# EAGLE design OMHBN (EAGLE 5.11)

## Sheet 1 of 2
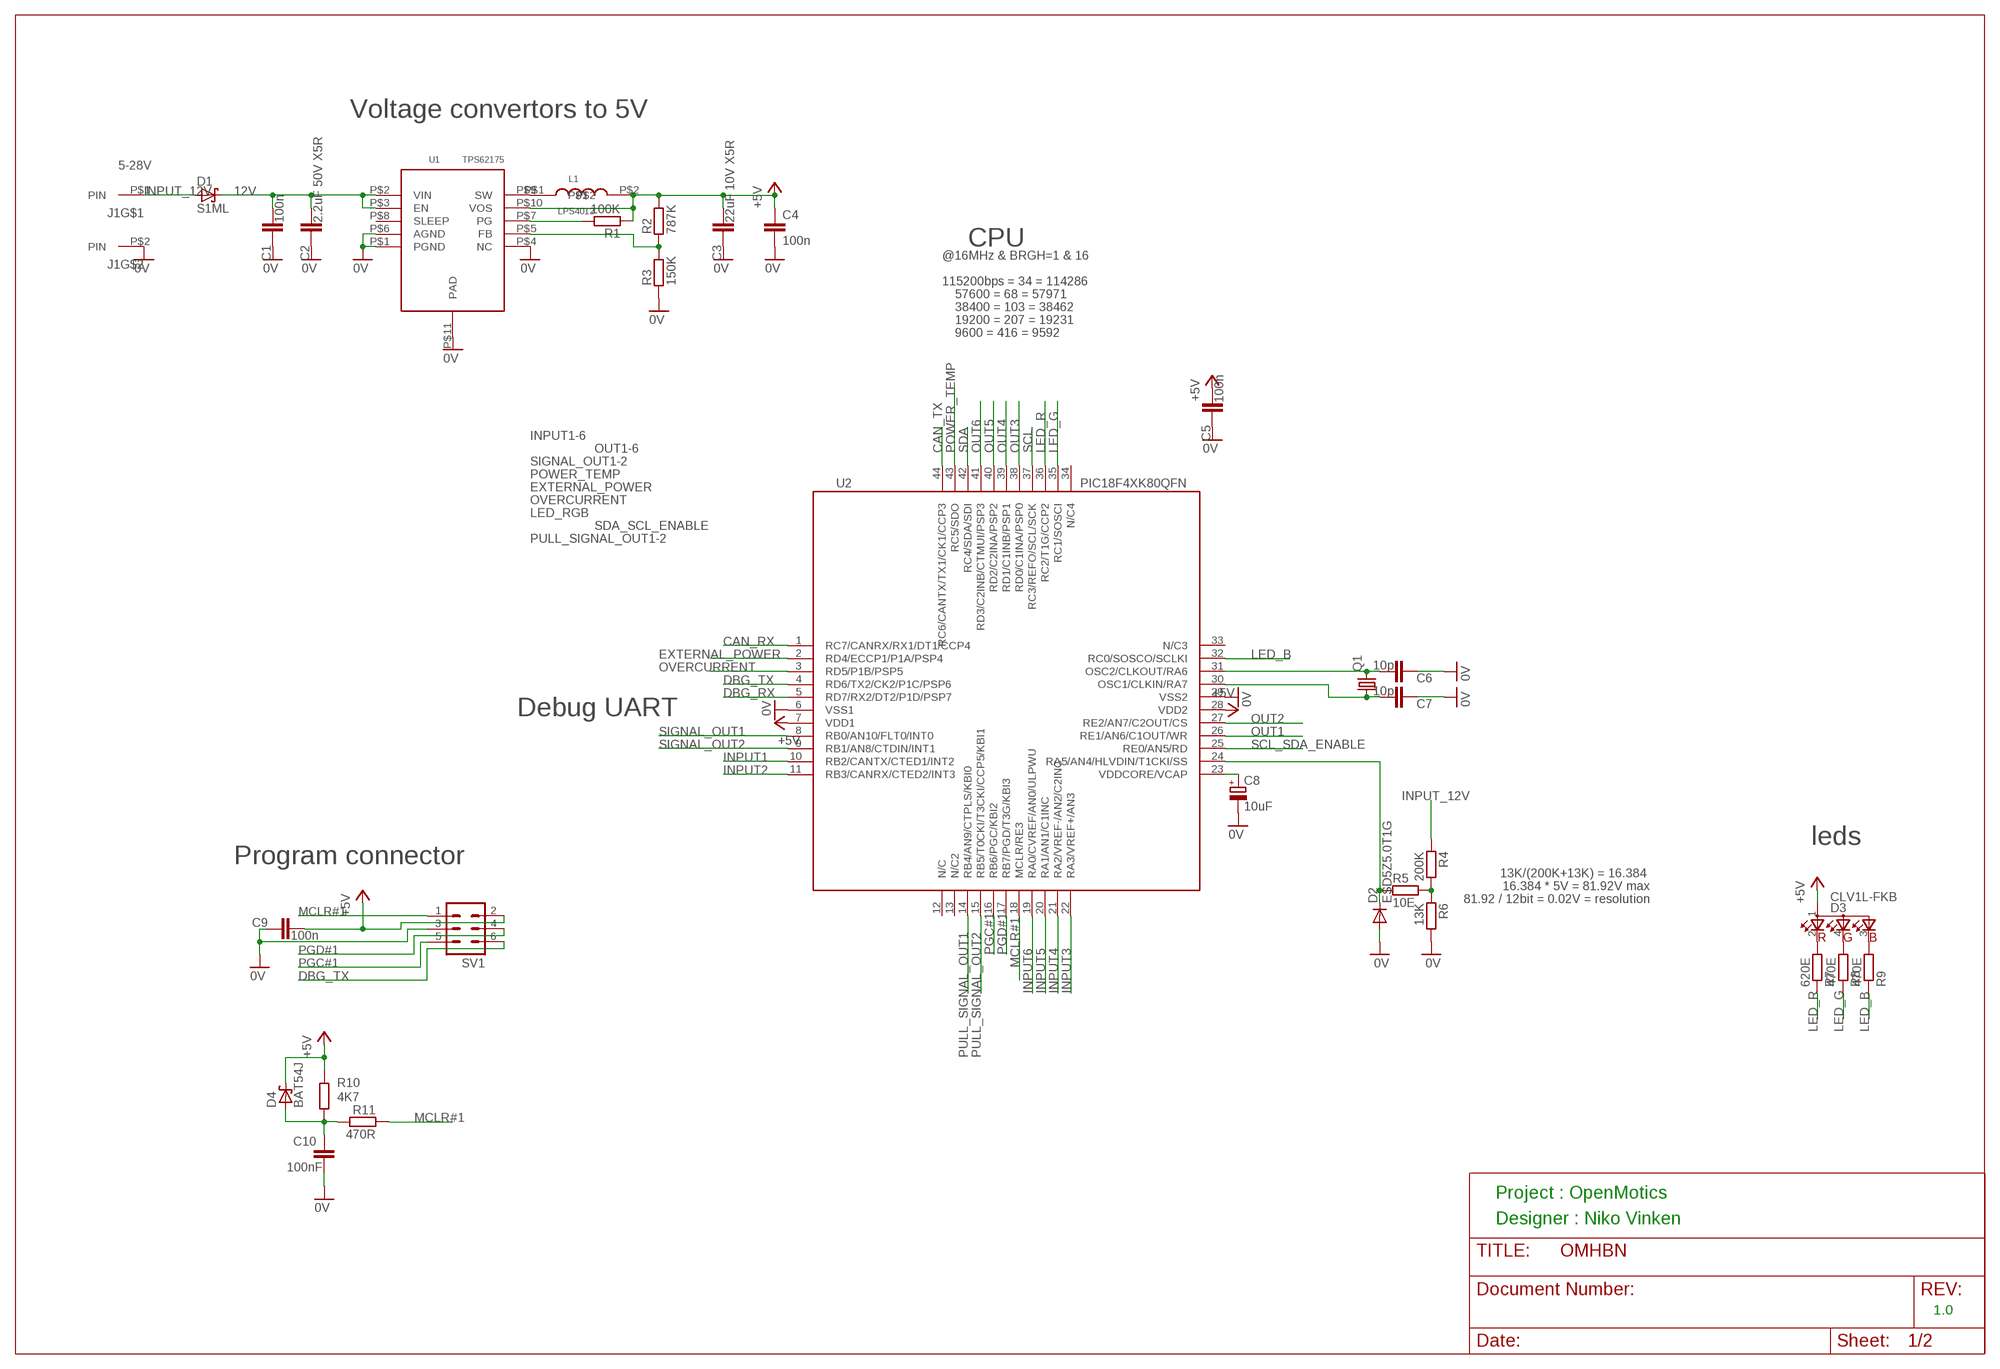
[diagram p0: schematic, sheet 1]

### Parts
C1  100n  C-EUC0603  [C0603]
C2  2.2uF 50V X5R  C-EUC1206  [C1206]
C3  22uF 10V X5R  C-EUC1206  [C1206]
C4  100n  C-EUC0603  [C0603]
C5  100n  C-EUC0603  [C0603]
C6  10p  C-EUC0603  [C0603]
C7  10p  C-EUC0603  [C0603]
C8  10uF  CPOL-EUA/3216-18W  [A/3216-18W]
C9  100n  C-EUC0603  [C0603]
C10  100nF  C-EUC0603  [C0603]
D1  S1ML  SMF5.0AT1  [SOD123FL]
D2  ESD5Z5.0T1G  DIODE-SOD523  [SOD523]
D3  CLV1L-FKB  [PLCC4]
D4  BAT54J  [SOD323_REFLOW]
J1  TERMINAL_2PIN3.81MM  [2PIN_TERMINAL_3.8MM]
L1  LPS4012  [LPS4012_REC]
Q1  CRYSTALCTS406  [CTS406]
R1  100K  R-EU_R0603  [R0603]
R2  787K  R-EU_R0603  [R0603]
R3  150K  R-EU_R0603  [R0603]
R4  200K  R-EU_R0603  [R0603]
R5  10E  R-EU_R0603  [R0603]
R6  13K  R-EU_R0603  [R0603]
R7  620E  R-EU_R0603  [R0603]
R8  470E  R-EU_R0603  [R0603]
R9  470E  R-EU_R0603  [R0603]
R10  4K7  R-EU_R0603  [R0603]
R11  470R  R-EU_R0603  [R0603]
SV1  MA03-2  [MA03-2]
U1  TPS62175  [QFN10]
U2  PIC18F4XK80QFN  [QFN44ML8X8]

### Nets
0V: C1.2 C2.2 C3.2 C4.2 C5.2 C6.2 C7.2 C8.- C9.2 C10.1 D2.A J1.P$2 R3.1 R6.2 SV1.3 U1.P$1(PGND) U1.P$4(NC) U1.P$6(AGND) U1.P$11(PAD) U2.6(VSS1) U2.29(VSS2) ; also sheet 2
12V: C1.1 C2.1 D1.C U1.P$2(VIN) U1.P$3(EN)
+5V: C3.1 C4.1 C5.1 C9.1 D3.1(A2) D4.1 L1.P$2 R1.1 R2.2 R10.2 SV1.2 U1.P$10(VOS) U2.7(VDD1) U2.28(VDD2) ; also sheet 2
CAN_RX: U2.1(RC7/CANRX/RX1/DT1/CCP4) ; also sheet 2
CAN_TX: U2.44(RC6/CANTX/TX1/CK1/CCP3) ; also sheet 2
DBG_RX: U2.5(RD7/RX2/DT2/P1D/PSP7)
DBG_TX: SV1.6 U2.4(RD6/TX2/CK2/P1C/PSP6)
EXTERNAL_POWER: U2.2(RD4/ECCP1/P1A/PSP4) ; also sheet 2
INPUT1: U2.10(RB2/CANTX/CTED1/INT2) ; also sheet 2
INPUT2: U2.11(RB3/CANRX/CTED2/INT3) ; also sheet 2
INPUT3: U2.22(RA3/VREF+/AN3) ; also sheet 2
INPUT4: U2.21(RA2/VREF-/AN2/C2INC) ; also sheet 2
INPUT5: U2.20(RA1/AN1/C1INC) ; also sheet 2
INPUT6: U2.19(RA0/CVREF/AN0/ULPWU) ; also sheet 2
INPUT_12V: D1.A J1.P$1 R4.1
LED_B: R9.1 U2.32(RC0/SOSCO/SCLKI)
LED_G: R8.1 U2.35(RC1/SOSCI)
LED_R: R7.1 U2.36(RC2/T1G/CCP2)
MCLR#1: R11.1 SV1.1 U2.18(MCLR/RE3)
N$1: R4.2 R5.2 R6.1
N$2: R1.2 U1.P$7(PG)
N$3: C10.2 D4.2 R10.1 R11.2
N$4: L1.P$1 U1.P$9(SW)
N$6: R2.1 R3.2 U1.P$5(FB)
N$10: D3.2(CRED) R7.2
N$11: D3.4(CBLUE) R8.2
N$12: D3.3(CGREEN) R9.2
N$19: D2.C R5.1 U2.24(RA5/AN4/HLVDIN/T1CKI/SS)
N$21: C7.1 Q1.1 U2.30(OSC1/CLKIN/RA7)
N$23: C6.1 Q1.3 U2.31(OSC2/CLKOUT/RA6)
N$33: C8.+ U2.23(VDDCORE/VCAP)
OUT1: U2.26(RE1/AN6/C1OUT/WR) ; also sheet 2
OUT2: U2.27(RE2/AN7/C2OUT/CS) ; also sheet 2
OUT3: U2.38(RD0/C1INA/PSP0) ; also sheet 2
OUT4: U2.39(RD1/C1INB/PSP1) ; also sheet 2
OUT5: U2.40(RD2/C2INA/PSP2) ; also sheet 2
OUT6: U2.41(RD3/C2INB/CTMUI/PSP3) ; also sheet 2
OVERCURRENT: U2.3(RD5/P1B/PSP5) ; also sheet 2
PGC#1: SV1.5 U2.16(RB6/PGC/KBI2)
PGD#1: SV1.4 U2.17(RB7/PGD/T3G/KBI3)
POWER_TEMP: U2.43(RC5/SDO) ; also sheet 2
PULL_SIGNAL_OUT1: U2.14(RB4/AN9/CTPLS/KBI0) ; also sheet 2
PULL_SIGNAL_OUT2: U2.15(RB5/T0CKI/T3CKI/CCP5/KBI1) ; also sheet 2
SCL: U2.37(RC3/REFO/SCL/SCK) ; also sheet 2
SCL_SDA_ENABLE: U2.25(RE0/AN5/RD) ; also sheet 2
SDA: U2.42(RC4/SDA/SDI) ; also sheet 2
SIGNAL_OUT1: U2.8(RB0/AN10/FLT0/INT0) ; also sheet 2
SIGNAL_OUT2: U2.9(RB1/AN8/CTDIN/INT1) ; also sheet 2
Unconnected: U1.P$8(SLEEP) U2.12(N/C) U2.13(N/C2) U2.33(N/C3) U2.34(N/C4)

### Notes on the sheet
- Voltage convertors to 5V
- 5-28V
- CPU
- @16MHz & BRGH=1 & 16
- 115200bps = 34 = 114286
- 57600 = 68 = 57971
- 38400 = 103 = 38462
- 19200 = 207 = 19231
- 9600 = 416 = 9592
- INPUT1-6
- OUT1-6
- SIGNAL_OUT1-2
- POWER_TEMP
- EXTERNAL_POWER
- OVERCURRENT
- LED_RGB
- SDA_SCL_ENABLE
- PULL_SIGNAL_OUT1-2
- Debug UART
- leds
- Program connector
- 13K/(200K+13K) = 16.384
- 16.384 * 5V = 81.92V max
- 81.92 / 12bit = 0.02V = resolution
- Project : OpenMotics
- Designer : Niko Vinken
- 1.0

## Sheet 2 of 2
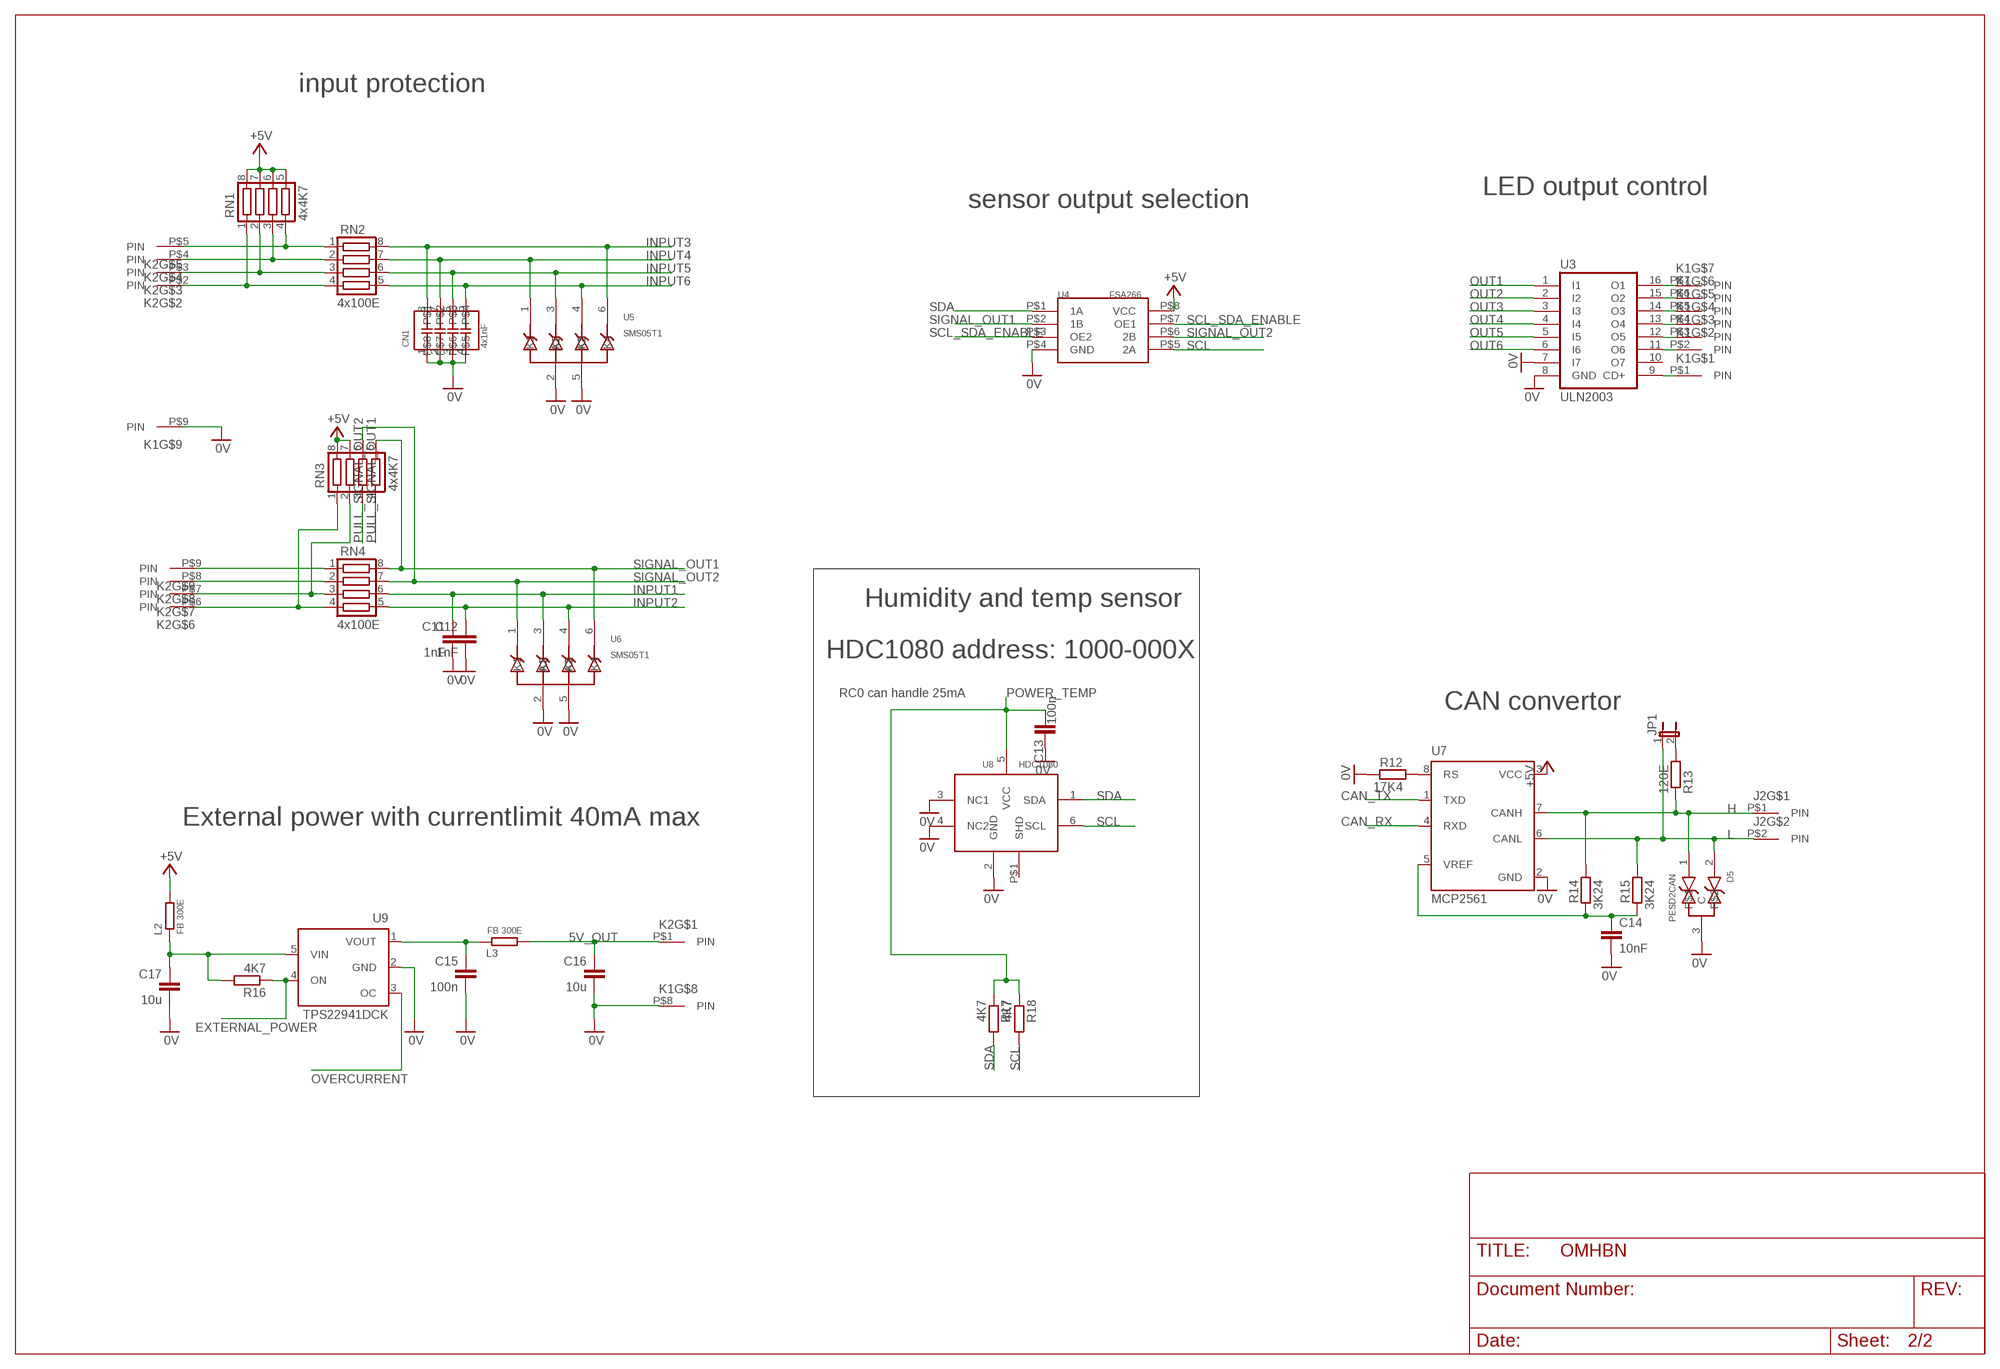
[diagram p1: schematic, sheet 2]

### Parts
C11  1nF  C-EUC0603  [C0603]
C12  1nF  C-EUC0603  [C0603]
C13  100n  C-EUC0603  [C0603]
C14  10nF  C-EUC0603  [C0603]
C15  100n  C-EUC0603  [C0603]
C16  10u  C-EUC0805  [C0805]
C17  10u  C-EUC0805  [C0805]
CN1  4x1nF  C_ARRAY  [C_ARRAY]
D5  PESD2CAN  NUP2105L  [SOT23]
J2  TERMINAL_2PIN3.81MM  [2PIN_TERMINAL_3.8MM]
JP1  JP1E  [JP1]
K1  SOLDER_PIN_9  [SOLDER_PIN_9]
K2  SOLDER_PIN_9  [SOLDER_PIN_9]
L2  FB 300E  WEERSTAND0603_REFLOW  [0603_REFLOW]
L3  FB 300E  WEERSTAND0603_REFLOW  [0603_REFLOW]
R12  17K4  R-EU_R0603  [R0603]
R13  120E  R-EU_R0603  [R0603]
R14  3K24  R-EU_R0603  [R0603]
R15  3K24  R-EU_R0603  [R0603]
R16  4K7  R-EU_R0603  [R0603]
R17  4K7  R-EU_R0603  [R0603]
R18  4K7  R-EU_R0603  [R0603]
RN1  4x4K7  CTS742C083  [CTS742C083]
RN2  4x100E  CTS742C083  [CTS742C083]
RN3  4x4K7  CTS742C083  [CTS742C083]
RN4  4x100E  CTS742C083  [CTS742C083]
U3  ULN2003  [TSSOP16]
U4  FSA266  [US8]
U5  SMS05T1  [SC-74]
U6  SMS05T1  [SC-74]
U7  MCP2561  PCA82C250T  [SO8]
U8  HDC1080  [PWSON_N6]
U9  TPS22941DCK  [DCK]

### Nets
0V: C11.2 C12.2 C13.2 C14.2 C15.2 C16.2 C17.2 CN1.1 CN1.2 CN1.3 CN1.4 D5.3(C) K1.P$8 K1.P$9 R12.1 U3.7(I7) U3.8(GND) U4.P$4(GND) U5.2(A1) U5.5(A2) U6.2(A1) U6.5(A2) U7.2(GND) U8.2(GND) U8.3(NC1) U8.4(NC2) U9.2(GND) ; also sheet 1
5V_OUT: C16.1 K2.P$1 L3.1
+5V: L2.2 RN1.5 RN1.6 RN1.7 RN1.8 RN3.7 RN3.8 U4.P$8(VCC) U7.3(VCC) ; also sheet 1
A: D5.1 J2.P$1 R13.1 R14.2 U7.7(CANH)
B: D5.2 J2.P$2 JP1.1 R15.2 U7.6(CANL)
CAN_RX: U7.4(RXD) ; also sheet 1
CAN_TX: U7.1(TXD) ; also sheet 1
EXTERNAL_POWER: R16.1 U9.4(ON) ; also sheet 1
INPUT1: C11.1 RN4.6 U6.3(K2) ; also sheet 1
INPUT2: C12.1 RN4.5 U6.4(K3) ; also sheet 1
INPUT3: CN1.8 RN2.8 U5.6(K4) ; also sheet 1
INPUT4: CN1.7 RN2.7 U5.1(K1) ; also sheet 1
INPUT5: CN1.6 RN2.6 U5.3(K2) ; also sheet 1
INPUT6: CN1.5 RN2.5 U5.4(K3) ; also sheet 1
N$5: JP1.2 R13.2
N$7: K1.P$1 U3.9(CD+)
N$8: C17.1 L2.1 R16.2 U9.5(VIN)
N$9: K1.P$2 U3.11(O6)
N$13: K2.P$7 RN3.2 RN4.3
N$14: K2.P$8 RN4.2
N$15: K2.P$9 RN4.1
N$16: K1.P$3 U3.12(O5)
N$17: K2.P$6 RN3.1 RN4.4
N$18: K1.P$4 U3.13(O4)
N$20: K1.P$7 U3.16(O1)
N$22: R12.2 U7.8(RS)
N$24: K1.P$6 U3.15(O2)
N$25: K2.P$2 RN1.1 RN2.4
N$26: K2.P$3 RN1.2 RN2.3
N$27: K1.P$5 U3.14(O3)
N$30: K2.P$4 RN1.3 RN2.2
N$31: K2.P$5 RN1.4 RN2.1
N$50: C15.1 L3.2 U9.1(VOUT)
N$56: C14.1 R14.1 R15.1 U7.5(VREF)
OUT1: U3.1(I1) ; also sheet 1
OUT2: U3.2(I2) ; also sheet 1
OUT3: U3.3(I3) ; also sheet 1
OUT4: U3.4(I4) ; also sheet 1
OUT5: U3.5(I5) ; also sheet 1
OUT6: U3.6(I6) ; also sheet 1
OVERCURRENT: U9.3(OC) ; also sheet 1
POWER_TEMP: C13.1 R17.1 R18.1 U8.5(VCC) ; also sheet 1
PULL_SIGNAL_OUT1: RN3.4 ; also sheet 1
PULL_SIGNAL_OUT2: RN3.3 ; also sheet 1
SCL: R18.2 U4.P$5(2A) U8.6(SCL) ; also sheet 1
SCL_SDA_ENABLE: U4.P$3(OE2) U4.P$7(OE1) ; also sheet 1
SDA: R17.2 U4.P$1(1A) U8.1(SDA) ; also sheet 1
SIGNAL_OUT1: RN3.5 RN4.8 U4.P$2(1B) U6.6(K4) ; also sheet 1
SIGNAL_OUT2: RN3.6 RN4.7 U4.P$6(2B) U6.1(K1) ; also sheet 1
Unconnected: U3.10(O7) U8.P$1(SHD)

### Notes on the sheet
- input protection
- LED output control
- sensor output selection
- Humidity and temp sensor
- HDC1080 address: 1000-000X
- RC0 can handle 25mA
- CAN convertor
- H
- External power with currentlimit 40mA max
- L

## Library data of the parts
C1-C7 C9-C17 = resistor:C-EU: CAPACITOR, European symbol
C8 = resistor:CPOL-EU: POLARIZED CAPACITOR, European symbol
CN1 = OpenMotics:C_ARRAY
D1 = diode:SMF5.0AT1: 200 W Transient Voltage Suppressor Source: Data sheet <http://www.onsemi.com/pub_link/Collateral/SMF5.0AT1-D.PDF>
D2 = diode:DIODE-: DIODE
D3 = OpenMotics:CLV1L-FKB
D4 = racktivity:BAT54J
D5 = OpenMotics:NUP2105L
J1 J2 = OpenMotics:TERMINAL_2PIN
JP1 = jumper:JP1E: JUMPER
K1 K2 = OpenMotics:SOLDER_PIN_9
L1 = OpenMotics:LPS4012
L2 L3 = Weerstand:WEERSTAND
Q1 = crystal:CRYSTAL: CRYSTAL; OC_FARNELL: unknown; OC_NEWARK: unknown
R1-R11 R13 R16-R18 = resistor:R-EU_: RESISTOR, European symbol
R12 R14 R15 = rcl:R-EU_: RESISTOR, European symbol
RN1-RN4 = resistor-net:CTS742C083: Chip Resistor Array 4 Single Resistor Source: http://www.ctscorp.com/components/Datasheets/CTSChipArrayDs.pdf; OC_FARNELL: unknown; OC_NEWARK: unknown
SV1 = con-lstb:MA03-2: PIN HEADER; OC_FARNELL: unknown; OC_NEWARK: unknown
U1 = OpenMotics:TPS62175
U2 = OpenMotics:PIC18F4XK80
U3 = OpenMotics:ULN2003
U4 = OpenMotics:FSA266
U5 U6 = OpenMotics:SMS05T1
U7 = micro-philips:PCA82C250: CAN CONTROLLER INTERFACE; OC_FARNELL: 1085275; OC_NEWARK: unknown
U8 = OpenMotics:HDC1080
U9 = racktivity:TPS22941

## Board
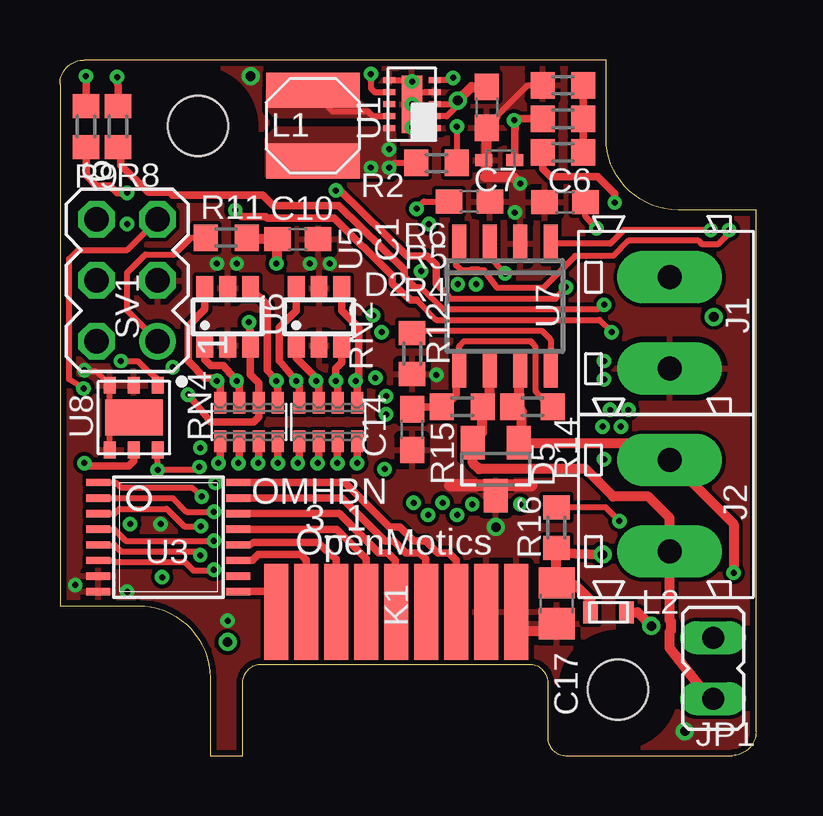
[diagram p2: board, top side]
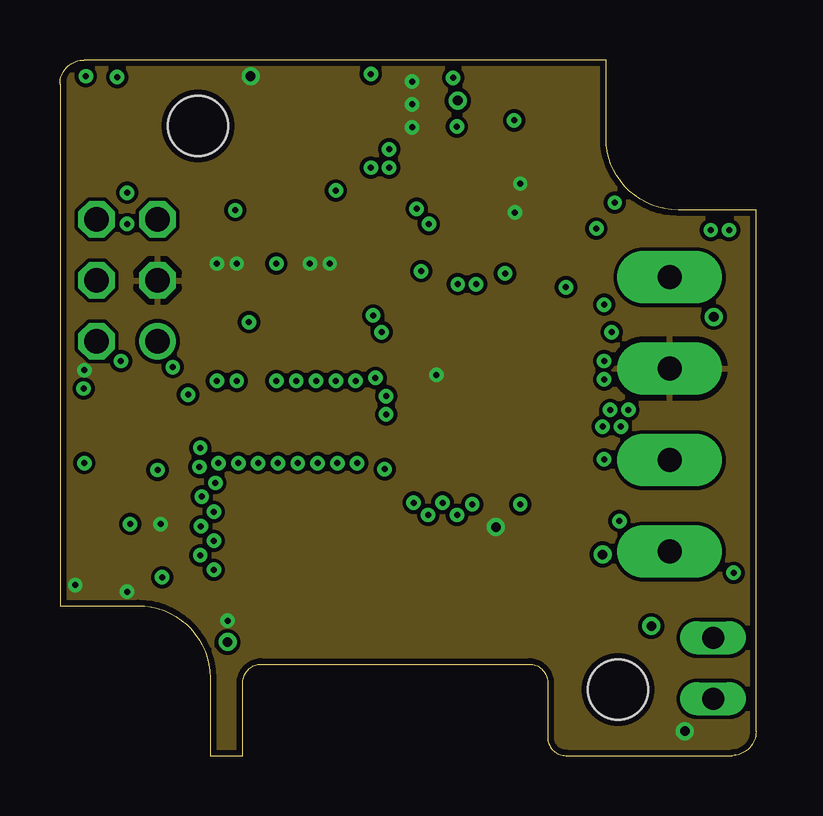
[diagram p3: board, inner layer Gnd]
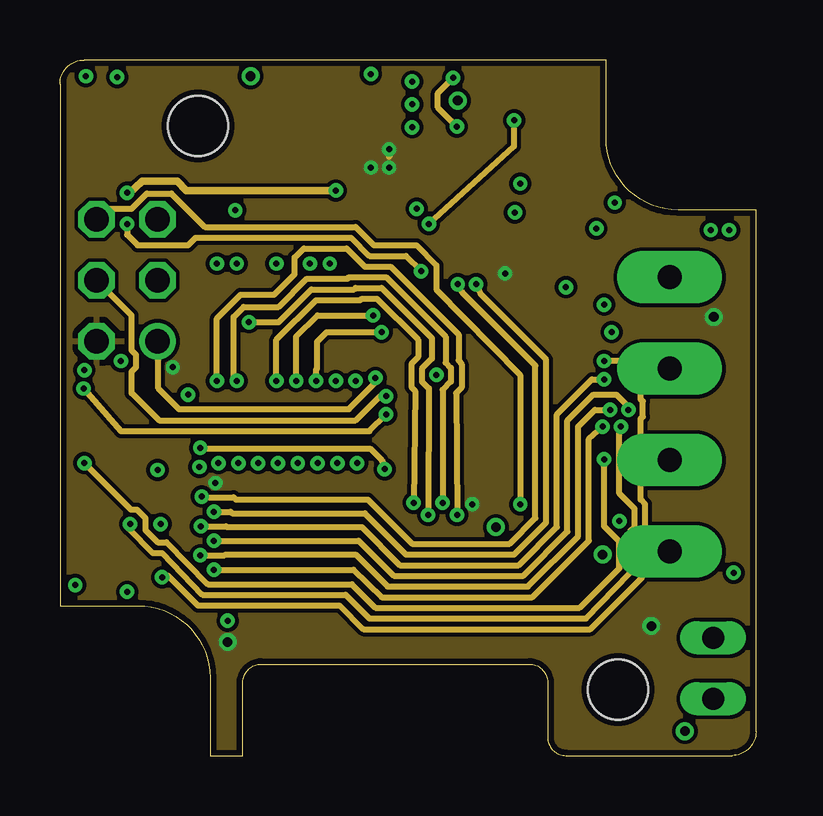
[diagram p4: board, inner layer 5V]
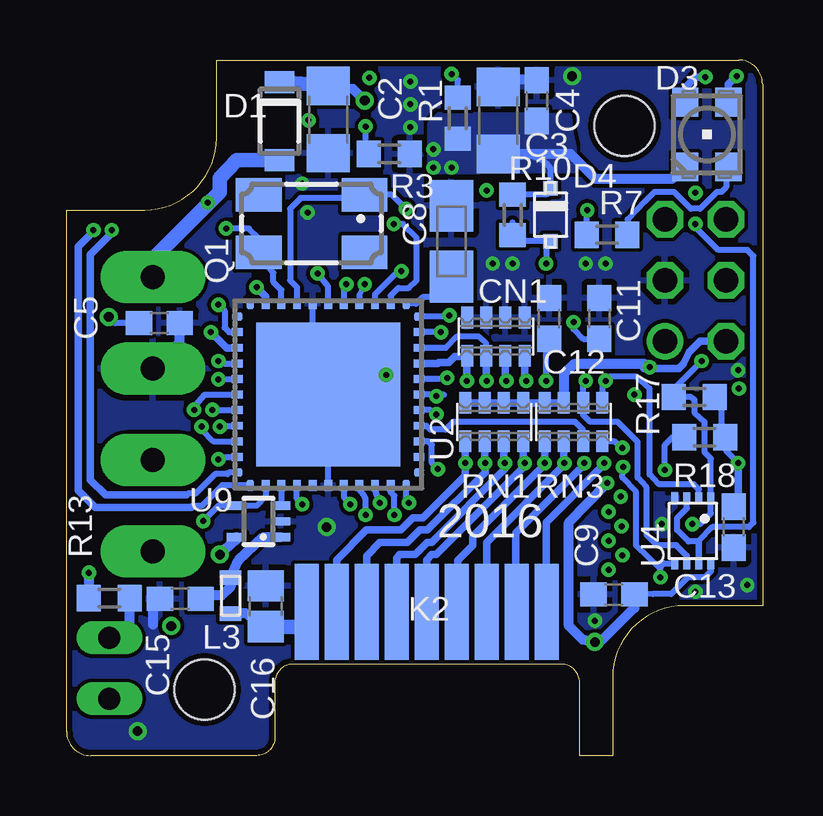
[diagram p5: board, bottom side, seen from below]

Size 29 x 29 mm. Coordinates in mm from the lower left corner, seen from the top.
Outline: 0,28 0,6.25 3.25,6.25 arc-90 6.25,3.25 6.25,0 7.62,0 7.62,3.05 arc-90 8.38,3.81 19.56,3.81 arc-90 20.32,3.05 20.32,0.76 arc90 21.08,0 28,0 arc90 29,1 29,22.75 25.75,22.75 arc-90 22.75,25.75 22.75,29 1,29 arc90 0,28
Copper layers (1+2+15+16): Top 0.035mm / dielectric 1.5mm / Gnd 0.035mm / dielectric 0.15mm / 5V 0.035mm / dielectric 0.2mm / Bottom 0.035mm
Design rules "default *": minimum track width 10mil, minimum drill 24mil, track to track 0.16mm, track to pad 0.16mm, pad to pad 0.16mm, via to via 0.16mm, smd to smd 0.16mm, copper to edge 10mil, drill to drill 8mil, minimum pad ring 0.175mm, minimum via ring 0.175mm, stop-mask expansion 4mil, vias tented up to drill 0mil, thermal gap 10mil
Holes 2.5 mm at 5.75,26.25 23.25,2.75
bKeepout: area 4,24.4 to 7.5,28.1; area 21.4,0.9 to 25.1,4.5; area 6.2,2.8 to 7.8,3.8; area 2.8,6.2 to 3.8,7.8; area 21.2,25.2 to 22.8,26.2; area 25.2,21.2 to 26.2,22.8
tRestrict: area 20.8,0.2 to 25.8,5.2; area 3.2,23.8 to 8.2,28.8

### Footprints (pad centres in the part's own frame; a part is rotated, then mirrored left to right if it is on the bottom)
C0603 = smd 1.1 x 1: 1 -0.85,0; 2 0.85,0
C1206 = smd 1.6 x 1.8: 1 -1.4,0; 2 1.4,0
A/3216-18W = smd 2.15 x 1.8: + 1.475,0; - -1.475,0
C0805 = smd 1.3 x 1.5: 1 -0.85,0; 2 0.85,0
C_ARRAY = smd 0.5 x 0.9: 1 -1.2,-0.8; 2 -0.4,-0.8; 3 0.4,-0.8; 4 1.2,-0.8; 5 1.2,0.8; 6 0.4,0.8; 7 -0.4,0.8; 8 -1.2,0.8
SOD123FL = smd 0.91 x 1.22: A 1.625,0; C -1.625,0
SOD523 = smd 0.7 x 0.5: A 0.7,0; C -0.6,0
PLCC4 = smd 1.1 x 1.2: 1 -0.9,-1.35; 2 0.9,-1.35; 3 0.9,1.35; 4 -0.9,1.35
SOD323_REFLOW = smd 0.6 x 0.6: 1 1.1,0; 2 -1.1,0
SOT23 = smd 1 x 1.4: 1 -0.95,-1.1; 2 0.95,-1.1; 3 0,1.1
2PIN_TERMINAL_3.8MM = drill 1 pad 2.184 long: P$1 -1.905,0; P$2 1.905,0
JP1 = drill 0.914 long: 1 0,-1.27; 2 0,1.27
SOLDER_PIN_9 = smd 1 x 4: P$1 -5,0; P$2 -3.75,0; P$3 -2.5,0; P$4 -1.25,0; P$5 0,0; P$6 1.25,0; P$7 2.5,0; P$8 3.75,0; P$9 5,0
LPS4012_REC = smd 1.45 x 3.89: P$1 -1.475,0; P$2 1.475,0
0603_REFLOW = smd 0.6 x 0.9: 1 -0.75,0; 2 0.75,0
CTS406 = smd 1.9 x 1.4: 1 -2.2,-1.2; 2 2.2,-1.2; 3 2.2,1.2; 4 -2.2,1.2
R0603 = smd 1 x 1.1: 1 -0.85,0; 2 0.85,0
CTS742C083 = smd 0.5 x 0.9: 1 -1.2,-0.8; 2 -0.4,-0.8; 3 0.4,-0.8; 4 1.2,-0.8; 5 1.2,0.8; 6 0.4,0.8; 7 -0.4,0.8; 8 -1.2,0.8
MA03-2 = drill 1.016 round: 1 -2.54,-1.27 | drill 1.016 octagon: 2 -2.54,1.27; 3 0,-1.27; 4 0,1.27; 5 2.54,-1.27; 6 2.54,1.27
QFN10 = smd 0.5 x 0.25: P$1 -0.95,1; P$2 -0.95,0.5; P$3 -0.95,0; P$4 -0.95,-0.5; P$5 -0.95,-1; P$6 0.95,-1; P$7 0.95,-0.5; P$8 0.95,0; P$9 0.95,0.5; P$10 0.95,1 | smd 0.84 x 2.4: P$11 0,0
QFN44ML8X8 = smd 0.45 x 0.33: 1 -3.788,3.25; 2 -3.788,2.6; 3 -3.788,1.95; 4 -3.788,1.3; 5 -3.788,0.65; 6 -3.788,0; 7 -3.788,-0.65; 8 -3.788,-1.3; 9 -3.788,-1.95; 10 -3.788,-2.6; 11 -3.788,-3.25; 23 3.788,-3.25; 24 3.788,-2.6; 25 3.788,-1.95; 26 3.788,-1.3; 27 3.788,-0.65; 28 3.788,0; 29 3.788,0.65; 30 3.788,1.3; 31 3.788,1.95; 32 3.788,2.6; 33 3.788,3.25 | smd 0.33 x 0.45: 12 -3.25,-3.788; 13 -2.6,-3.788; 14 -1.95,-3.788; 15 -1.3,-3.788; 16 -0.65,-3.788; 17 0,-3.788; 18 0.65,-3.788; 19 1.3,-3.788; 20 1.95,-3.788; 21 2.6,-3.788; 22 3.25,-3.788; 34 3.25,3.788; 35 2.6,3.788; 36 1.95,3.788; 37 1.3,3.788; 38 0.65,3.788; 39 0,3.788; 40 -0.65,3.788; 41 -1.3,3.788; 42 -1.95,3.788; 43 -2.6,3.788; 44 -3.25,3.788 | smd 6 x 6: EXP 0,0
TSSOP16 = smd 0.305 x 0.991: 1 -2.24,-3.102; 2 -1.59,-3.102; 3 -0.94,-3.102; 4 -0.29,-3.102; 5 0.36,-3.102; 6 1.01,-3.102; 7 1.66,-3.102; 8 2.31,-3.102; 9 2.31,2.734; 10 1.66,2.734; 11 1.01,2.734; 12 0.36,2.734; 13 -0.29,2.734; 14 -0.94,2.734; 15 -1.59,2.734; 16 -2.24,2.734
US8 = smd 0.3 x 0.5: P$1 -0.75,-1.35; P$2 -0.25,-1.35; P$3 0.25,-1.35; P$4 0.75,-1.35; P$5 0.75,1.35; P$6 0.25,1.35; P$7 -0.25,1.35; P$8 -0.75,1.35
SC-74 = smd 0.7 x 1: 1 -0.95,-1.2; 2 0,-1.2; 3 0.95,-1.2; 4 0.95,1.2; 5 0,1.2; 6 -0.95,1.2
SO8 = smd 0.6 x 1.6: 1 -1.905,-2.6; 2 -0.635,-2.6; 3 0.635,-2.6; 4 1.905,-2.6; 5 1.905,2.6; 6 0.635,2.6; 7 -0.635,2.6; 8 -1.905,2.6
PWSON_N6 = smd 0.5 x 0.7: 1 -1,-1.35; 2 0,-1.35; 3 1,-1.35; 4 1,1.35; 5 0,1.35; 6 -1,1.35 | smd 2.4 x 1.5: P$1 0,0
DCK = smd 0.35 x 0.8: 1 -0.65,-0.925; 2 0,-0.925; 3 0.65,-0.925; 4 0.65,0.925; 5 -0.65,0.925

### Placement (x,y rotation side)
C1  17.78,27.02 270 top
C2  18.1,26.51 270 bottom
C3  11.01,26.48 90 bottom
C4  9.4,27.31 90 bottom
C5  25.13,18.02 0 bottom
C6  21.04,23.07 180 top
C7  17.06,23.1 0 top
C8  12.96,21.44 270 bottom
C9  6.19,6.72 180 bottom
C10  9.91,21.53 180 top
C11  6.79,18.22 90 bottom
C12  8.89,18.22 90 bottom
C13  1.21,9.53 270 bottom
C14  14.67,13.59 270 top
C15  24.26,6.54 180 bottom
C16  20.7,6.22 90 bottom
C17  20.7,6.35 270 top
CN1  11.11,17.46 180 bottom
D1  20.13,26.45 270 bottom
D2  18.35,24.83 180 top
D3  2.32,25.89 0 bottom
D4  8.83,22.54 90 bottom
D5  18.16,11.94 180 top
J1  25.4,18.03 270 top
J2  25.4,10.41 270 top
JP1  27.21,3.64 0 top
K1  14,6 0 top
K2  14,6 0 bottom
L1  10.54,26.26 270 top
L2  22.86,5.97 0 top
L3  22.16,6.67 90 bottom
Q1  18.79,22.18 180 bottom
R1  12.7,26.58 90 bottom
R2  15.68,24.7 180 top
R3  15.56,25.08 180 bottom
R4  20.95,25.15 0 top
R5  20.95,26.54 0 top
R6  20.95,27.94 180 top
R7  6.48,21.71 0 bottom
R8  2.42,26.22 90 top
R9  1.08,26.22 90 top
R10  10.41,22.54 90 bottom
R11  6.92,21.59 0 top
R12  14.67,16.76 90 top
R13  27.22,6.56 0 bottom
R14  19.68,14.54 180 top
R15  16.76,14.54 0 top
R16  20.68,9.5 270 top
R17  2.84,14.95 180 bottom
R18  2.41,13.27 180 bottom
RN1  11.18,13.91 0 bottom
RN2  11.18,13.91 0 top
RN3  7.87,13.91 0 bottom
RN4  7.87,13.91 0 top
SV1  2.79,19.81 90 top
U1  14.67,27.15 180 top
U2  18.1,15.05 90 bottom
U3  4.7,9.14 270 top
U4  2.91,9.37 180 bottom
U5  10.79,18.29 0 top
U6  6.99,18.29 0 top
U7  18.54,18.74 180 top
U8  3.08,14.08 180 top
U9  21,9.76 90 bottom

### Tracks (layer width: path | path; a pad name or v marks a point on that pad's centre or on a via)
0V  (via drill 0.25 pad 0.6, 0.4)
  Top 0.254: U1.P$6 14.62,28.15 | 15.17,27.65 U1.P$4 14.95,27.65 14.92,27.62 | 14.72,26.15 U1.P$1 | U8.4 U8.3 1.51,16 1.02,16 | R6.2 19.49,27.94 18.22,26.67 18.22,26.61 C1.2
  Top 0.305: 14.92,27.62 14.67,27.88
  Top 0.406: C17.2 20.66,5.21 18.92,5.21 | C1.2 17.78,24.2 17.72,24.13 18.86,24.13 v19.18,23.84
  Top 0.5: 16.26,11.27 19.65,11.27
  Bottom 0.254: 10.41,28.19 | 10.41,28.19 10.41,28.17 C3.2 | U2.6 18.1,16.45 18.73,17.08 18.73,18.86
  Bottom 0.406: C5.2 24.28,17.25 J1.P$2 | C15.2 25.4,6.25 25.4,5.46 | C4.2 9.41,28.17 10.41,28.17
  other vias: 26.04,1.02 2.79,6.83 6.54,20.51 7.37,20.51 10.41,20.51 11.24,20.51 18.16,9.53 18.95,22.64 7.94,28.32 15.68,15.88 4.19,9.65 6.99,5.62 0.64,7.11 1.02,16.07 14.67,28.1 14.67,27.15 14.67,26.19
  pour Bottom (rank 2): -4.06,31.11 30.48,31.11 30.48,-2.92 -4.06,-2.92 -4.06,30.99
  pour Top (rank 2): -4.06,31.11 30.48,31.11 30.48,-2.92 -4.06,-2.92 -4.06,30.99
  pour Gnd: -2.67,31.11 31.88,31.11 31.88,-2.92 -2.67,-2.92 -2.67,30.99
5V_OUT
  Bottom 0.406: 20.83,5.25 21.5,5.92 L3.1
  Bottom 0.61: 20.83,5.25 arc-90 C16.1 19,5.37 K2.P$1
12V  (via drill 0.4)
  Top 0.254: U1.P$3 16.42,27.15 v16.57,27.3 16.57,27.11 16.11,26.65 U1.P$2
  Top 0.406: v16.57,27.3 17.14,27.87 C1.1
  Bottom 0.406: C2.1 17.05,27.79 v16.57,27.3
  Bottom 0.61: C2.1 18.19,27.94 D1.C
+5V  (via drill 0.25 pad 0.6, 0.4)
  Top 0.254: v13.72,24.51 13.91,24.7 R2.2 | U7.3 17.78,20.89 v18.54,20.1
  Top 0.406: L2.2 24.07,5.97 v24.64,5.4
  5V 0.254: v13.72,25.27 13.72,24.96
  Bottom 0.254: U2.7 17.45,10.78 v17.18,10.48 | R10.2 9.01,23.39 9,23.39 8.83,23.56 D4.1 8.83,24.47 arc-90 10.47,24.79 | C5.1 26.98,18.02 v27.24,18.29 | U2.28 18.1,19.56 v18.54,20.1 | U4.P$8 2.15,7.69 2.41,7.43 3.11,7.43 3.81,6.73 4.57,6.73 C9.1
  Bottom 0.305: RN1.8 RN1.7 RN1.6 RN1.5 RN3.8 RN3.7 | SV1.2 2.6,17.27 3.05,16.83 3.3,16.32 3.49,16.13 4.95,16.13 v4.7,16.19
  Bottom 0.406: D3.1 3.24,24.45 3.78,24.04 6.95,24.04 8,25.08 C3.1 | RN3.7 8.27,15.92 7.87,16.32 4.89,16.32 v4.7,16.19 | C9.1 5.34,6.15 6.67,4.83 v6.99,4.73 7.49,4.83 8.06,5.4 8.06,9.72 v6.48,11.37
  other vias: 12.95,24.51
  pour 5V: -3.56,31.31 30.99,31.31 30.99,-2.73 -3.56,-2.73 -3.56,31.18
  pour Top (no thermals): 8.64,24.19 13.72,24.19 13.91,24.38 13.91,25.91 13.72,26.1 9.02,26.1 8.64,25.72
  pour Bottom (no thermals): 7.87,24.38 13.72,24.32 13.84,24.38 13.84,26.35 13.46,26.73 8.06,26.67 8,25.97 7.94,25.59 7.87,25.34
A  (via drill 0.25 pad 0.6)
  Top 0.406: 23.98,13.04 D5.1 19.24,13.22 19.24,14.33 arc90 R14.2 19.15,14.63 19.14,15.59 19.18,15.62 U7.7 | J2.P$1 28.07,9.65 v28.07,7.62
  Top 0.61: 23.98,13.04 24.64,12.38 25.34,12.38 J2.P$1
  Bottom 0.406: v28.07,7.62 28.07,7.49 R13.1
B
  Top 0.406: U7.6 17.91,14.64 R15.2 17.59,14.39 17.59,13.46 17.52,13.39 D5.2 17.2,12.2 17.46,11.94 21.91,11.94 23.05,10.79 24.51,10.79 25.4,9.91 J2.P$2 25.4,5.65 25.46,5.59 25.46,5.21 25.4,5.14 25.4,4.5 26.99,2.48 JP1.1
CAN_RX  (via drill 0.25 pad 0.6)
  Top 0.254: U7.4 16.51,20.45 16.73,20.23 17.08,20.23 17.11,20.26 17.46,20.26 17.49,20.23 17.68,20.23 18.22,19.49 20.13,19.49 21.46,20.83 23.05,20.83 23.69,21.46 26.61,21.46 26.77,21.3 27.4,21.3 27.88,21.78 v27.88,21.91
  Bottom 0.254: U2.1 22.52,11.26 23.37,10.41 23.75,10.41 23.81,10.35 | 27.88,21.84 v27.88,21.91
  Bottom 0.305: 23.81,10.35 27.81,10.35 28.51,11.05 28.51,21.21 27.88,21.84
CAN_TX  (via drill 0.25 pad 0.6)
  Top 0.254: U7.1 20.38,21.4 20.45,21.4 20.51,21.34 22.92,21.34 23.5,21.91 v27.11,21.91
  Bottom 0.254: U2.44 22.24,11.8 22.3,11.74 22.81,11.74 23.62,10.92 23.94,10.92 24,10.86 | 27.11,21.78 v27.11,21.91
  Bottom 0.305: 24,10.86 27.37,10.86 28,11.49 28,20.89 27.11,21.78
DBG_TX  (via drill 0.25 pad 0.6)
  5V 0.254: v19.18,10.48 19.18,15.88 15.68,19.43 15.68,20.45 14.86,21.27 13.08,21.27 12.32,22.04 6.03,22.04 4.64,23.43 3.62,23.43 2.98,22.8 1.97,22.8 SV1.6 1.59,22.42
  Bottom 0.254: U2.4 19.4,10.7 v19.18,10.48
EXTERNAL_POWER  (via drill 0.25 pad 0.6)
  Top 0.254: v23.3,9.78 22.73,10.35 20.76,10.35 20.76,10.31 20.72,10.33 R16.1
  Bottom 0.254: U2.2 20.7,10.8 21.08,10.41 U9.4 22.67,10.41 v23.3,9.78
INPUT1  (via drill 0.25 pad 0.6)
  Top 0.305: v7.87,18.07 7.93,17.66 U6.3 7.93,15.88 8.27,15.54 RN4.6 8.27,14.12 8.06,13.91 6.29,13.91 v5.33,15.05
  5V 0.254: v15.34,10.03 15.37,15.3 15.08,15.59 15.08,16.13 15.49,16.54 15.49,17.4 13.4,19.49 12.32,19.49 12.26,19.43 10.48,19.43 9.11,18.07 v7.87,18.07
  Bottom 0.254: U2.10 15.49,11.05 15.49,10.99 15.34,10.83 v15.34,10.03 | C11.1 7.47,17.38 7.87,17.78 v7.87,18.07
  Bottom 0.305: v7.87,18.07 7.89,18.05
INPUT2  (via drill 0.25 pad 0.6)
  Top 0.305: RN4.5 9.07,15.56 v9.02,15.62 8.64,16.07 8.64,18.8 U6.4
  5V 0.254: v14.73,10.54 14.8,15.21 14.64,15.37 14.64,16.32 14.92,16.61 14.92,17.34 13.21,19.05 12.57,19.05 12.51,18.99 10.67,18.99 9.02,17.34 v9.02,15.62
  Bottom 0.254: U2.11 14.85,10.62 v14.73,10.54 | C12.1 9.02,17.25 v9.02,15.62
  Bottom 0.305: v9.02,15.62 9.07,15.68
INPUT3  (via drill 0.25 pad 0.6)
  Top 0.305: RN2.8 9.98,15.49 v9.84,15.62 9.14,16.48 9.14,17.84 9.85,18.54 U5.6
  5V 0.254: v13.05,18.35 10.73,18.35 9.84,17.46 v9.84,15.62
  Bottom 0.254: U2.22 13.16,18.3 v13.05,18.35
  Bottom 0.305: CN1.8 9.91,15.69 v9.84,15.62
INPUT4  (via drill 0.25 pad 0.6)
  Top 0.305: RN2.7 10.78,15.51 v10.67,15.62 10.67,15.75 9.85,16.57 U5.1
  5V 0.254: v13.4,17.65 11.11,17.65 10.71,17.25 10.71,16.13 10.67,16.08 v10.67,15.62
  Bottom 0.254: U2.21 13.66,17.65 v13.4,17.65
  Bottom 0.305: CN1.7 10.71,15.66 v10.67,15.62
INPUT5  (via drill 0.25 pad 0.6)
  Top 0.305: RN2.6 11.58,15.54 v11.49,15.62 11.49,16.13 11.74,16.38 U5.3
  Bottom 0.254: U2.20 13.2,17 12.73,17.46 11.81,17.46 11.51,17.19 CN1.6
  Bottom 0.305: CN1.6 11.51,15.64 v11.49,15.62
INPUT6  (via drill 0.25 pad 0.6)
  Top 0.305: RN2.5 12.38,15.56 v12.32,15.62 12.45,15.75 12.45,17.84 11.74,18.54 U5.4
  Bottom 0.305: v12.32,15.62 CN1.5 12.34,16.64 12.83,16.64 13.08,16.38 13.49,16.38 13.53,16.35 U2.19
INPUT_12V  (via drill 0.25 pad 0.6)
  Top 0.305: R4.1 20.11,24.47 20.45,24.13 22.42,24.13 23.11,23.43 v23.11,23.05
  Bottom 0.305: v23.11,23.05 23.11,22.99 23.24,22.86
  Bottom 0.61: D1.A 21.92,24.82 22.61,24.07 22.61,23.5 23.24,22.86 25.4,20.7 J1.P$1
LED_B  (via drill 0.25 pad 0.6)
  Top 0.254: 15.68,19.65 16.29,19.05 20.64,19.05 v21.08,19.53
  Top 0.305: 15.68,19.65 15.68,20.45 15.3,20.83 14.48,20.83 11.68,23.56 v11.49,23.56 | R9.1 1.08,24.19 1.52,23.75 2.1,23.75 2.38,23.46 v2.79,23.46
  5V 0.305: 11.56,23.56 v11.49,23.56 5.27,23.56 4.89,23.94 3.43,23.94 2.86,23.43 v2.79,23.46
  Bottom 0.305: v21.08,19.53 20.7,19.14 U2.32
LED_G  (via drill 0.25 pad 0.6)
  Top 0.254: 15.05,19.49 15.94,18.61 22.42,18.61 v22.67,18.8
  Top 0.305: 15.05,19.49 14.8,19.49 14.35,19.94 14.35,20.26 11.62,22.92 8.89,22.92 8.45,23.37 4.7,23.37 4.57,23.5 3.68,23.5 2.54,24.61 2.54,25.25 R8.1
  Bottom 0.254: U2.35 22.22,17.65 22.42,17.84 22.42,18.54 v22.67,18.8
LED_R  (via drill 0.25 pad 0.6)
  Top 0.254: 14.86,18.99 15.68,18.16 22.48,18.16 v22.99,17.65
  Top 0.305: v7.3,22.73 7.56,22.48 8.57,22.48 8.64,22.42 11.43,22.42 13.84,20 13.84,19.68 14.61,18.99 14.86,18.99
  Bottom 0.254: R7.1 7.33,22.71 v7.3,22.73
  Bottom 0.305: v22.99,17.65 22.33,17 U2.36
MCLR#1  (via drill 0.25 pad 0.6)
  Top 0.254: R11.1 5.46,21.59 4.76,20.89 3.56,20.89 2.79,20.13 2.79,18.54 SV1.1
  5V 0.254: SV1.1 4.13,17.21 4.13,17.08 4.1,17.05 4.1,15.3 4.95,14.45 12.03,14.45 13.14,15.56 v13.14,15.75
  Bottom 0.254: U2.18 13.22,15.7 v13.14,15.75
N$1
  Top 0.305: R6.1 R5.2 R4.2
N$2  (via drill 0.25 pad 0.6)
  Top 0.254: U1.P$7 13.12,27.65 12.95,27.81 v12.95,28.42
  Bottom 0.254: R1.2 12.69,28.16 v12.95,28.42
N$3  (via drill 0.25 pad 0.6)
  Top 0.406: C10.2 7.83,21.53 R11.2 | C10.2 9.06,21.68 9.02,21.72 | C10.2 9.06,20.55 v9.02,20.51
  Bottom 0.254: v9.02,20.51 9.02,21.29 8.79,21.44 8.83,21.46 D4.2 10.31,21.44 10.41,22.23 R10.1
N$4
  Top 0.254: U1.P$9 13.04,26.65 12.83,26.86 11.35,26.86 L1.P$1
  pour Top (no thermals): 13.02,26.67 9.02,26.67 8.7,26.99 8.7,27.75 9.02,28.07 11.62,28.07 12.83,26.86
N$5
  Bottom 0.406: JP1.2 26.37,4.91 R13.2
N$6  (via drill 0.25 pad 0.6)
  Top 0.254: U1.P$5 16.27,28.15 v16.38,28.26 | v16.54,26.23 R2.1
  5V 0.254: v16.38,28.26 15.75,27.62 15.75,27.01 v16.54,26.23
  Bottom 0.254: 16.51,26.16 v16.54,26.23 16.54,25.36 16.38,25.21 R3.2
N$7
  Top 0.305: U3.9 8.61,6.83 8.83,7.05 | 8.83,7.05 8.79,7.09 | 8.83,7.05 9.02,6.86 9.02,6.02 K1.P$1
N$8  (via drill 0.4)
  Top 0.406: L2.1 22.11,6.46 21.46,7.11 20.74,7.11 C17.1 20.68,7.22 R16.2 20.89,8.45 v22.61,8.38
  Bottom 0.406: U9.5 21.94,8.99 v22.61,8.38
N$9
  Top 0.305: K1.P$2 10.25,8.16 10.03,8.38 8.26,8.38 8,8.13 7.18,8.13 U3.11
N$10
  Bottom 0.254: 1.51,24.19 1.51,23.7 1.71,23.5 1.91,23.5 2.6,22.8 2.98,22.8 3.68,23.5 4.51,23.5 4.89,23.11 5.62,22.35 R7.2
  Bottom 0.305: D3.2 1.51,24.19
N$11  (via drill 0.25 pad 0.6)
  Top 0.305: R8.2 2.42,27.82 v2.38,28.29
  Bottom 0.305: 3.22,27.39 D3.4 3.22,27.83 2.83,28.29 v2.38,28.29
N$12  (via drill 0.25 pad 0.6)
  Top 0.305: R9.2 1.08,28.19 v1.08,28.32
  Bottom 0.305: v1.08,28.32 1.42,27.98 D3.3
N$13  (via drill 0.25 pad 0.6)
  Top 0.305: v8.26,12.19 8.27,12.21 RN3.2
  Bottom 0.305: K2.P$7 11.5,8.88 8.26,12.13 v8.26,12.19 8.27,12.21 RN3.2
N$14  (via drill 0.25 pad 0.6)
  Top 0.305: 7.47,12.87 RN4.2 7.47,12.24 v7.43,12.19
  Bottom 0.305: K2.P$8 10.29,6.04 10.29,9.27 7.43,12.13 v7.43,12.19 7.47,12.24
N$15  (via drill 0.25 pad 0.6)
  Top 0.305: v6.6,12.19 6.67,12.26 RN4.1
  Bottom 0.305: K2.P$9 9.02,6.02 9.02,9.72 6.67,12.06 6.6,12.13 v6.6,12.19 6.67,12.26
N$16
  Top 0.305: K1.P$3 11.5,8.19 10.77,8.85 10.73,8.89 8.06,8.89 7.89,8.78 U3.12
N$17  (via drill 0.25 pad 0.6)
  Top 0.305: RN3.1 v9.07,12.2 v9.08,12.19
  Bottom 0.305: K2.P$6 12.75,7.82 12.7,7.87 12.7,8.13 12.06,8.76 12.06,9.14 9.08,12.13 v9.08,12.19 v9.07,12.2 RN3.1
N$18
  Top 0.305: K1.P$4 12.75,8.21 11.52,9.43 U3.13
N$19  (via drill 0.25 pad 0.6)
  Top 0.254: v18.92,26.48 18.99,26.52 D2.C
  Top 0.305: R5.1 18.96,26.54 D2.C
  5V 0.254: v15.37,22.16 18.92,25.4 v18.92,26.48
  Bottom 0.254: U2.24 15.5,19.17 15.18,19.49 14.73,19.49 14.41,19.81 14.41,21.59 14.99,22.16 v15.37,22.16
N$20
  Top 0.305: U3.16 11.86,11.38 13.72,9.53 14.16,9.53 14.73,8.95 15.24,8.95 15.75,8.45 16.19,8.45 16.51,8.13 K1.P$7
N$21  (via drill 0.25 pad 0.6)
  Top 0.254: C7.1 15.16,23.1 v14.86,22.8
  Bottom 0.254: U2.30 19.4,19.52 19.68,19.81 19.68,22.8 19.24,23.24 17.14,23.24 16.61,23.11 Q1.1 15.44,23.38 v14.86,22.8
N$22
  Top 0.254: U7.8 20.45,17.34 20.07,17.72 15.01,17.72 14.82,17.53
  Top 0.305: R12.2 14.82,17.53
N$23  (via drill 0.25 pad 0.6)
  Top 0.254: C6.1 21.89,22.5 v22.35,21.97
  Bottom 0.254: U2.31 20.05,19.41 20.38,19.75 20.38,20.12 Q1.3 21.02,20.76 21.02,21.59 21.4,21.97 v22.35,21.97
N$24
  Top 0.305: U3.15 11.74,10.73 13.53,8.95 13.91,8.95 14.41,8.45 14.99,8.45 15.24,8.19 K1.P$6
N$25  (via drill 0.25 pad 0.6)
  Top 0.305: v12.38,12.19 RN1.1
  Bottom 0.305: K2.P$2 17.75,8.16 16.51,9.4 15.08,9.4 14.57,9.91 14.16,9.91 12.38,11.68 v12.38,12.19 | 12.45,12.06 12.38,12.13 v12.38,12.19 | RN1.1 v12.38,12.2 v12.38,12.19
N$26  (via drill 0.25 pad 0.6)
  Top 0.305: v11.56,12.19 11.56,13.09 RN1.2
  Bottom 0.305: K2.P$3 16.5,8.33 15.94,8.89 14.8,8.89 14.29,9.4 13.97,9.4 11.56,11.81 v11.56,12.19 | v11.56,12.19 11.56,12.13 | RN1.2 11.58,12.21 v11.56,12.19
N$27
  Top 0.305: U3.14 11.63,10.08 13.27,8.45 13.65,8.45 13.97,8.13 13.97,6.03 K1.P$5
N$30  (via drill 0.25 pad 0.6)
  Top 0.305: v10.73,12.19 10.78,12.24 RN1.3
  Bottom 0.305: K2.P$4 15.25,8.24 15.11,8.38 14.48,8.38 13.97,8.89 13.78,8.89 10.73,11.94 v10.73,12.19 | v10.73,12.19 10.73,12.13 | RN1.3 10.78,12.24 v10.73,12.19
N$31  (via drill 0.25 pad 0.6)
  Top 0.305: v9.91,12.19 9.98,12.26 RN1.4
  Bottom 0.305: K2.P$5 14,8.16 13.78,8.38 13.59,8.38 9.91,12.06 v9.91,12.19 | v9.91,12.19 9.91,12.13 | RN1.4 9.98,12.26 v9.91,12.19
N$33
  Bottom 0.254: U2.23 14.44,18.84 14.16,19.11 13.81,19.11 C8.+
N$50
  Bottom 0.406: C15.1 23.28,6.67 22.54,6.67 22.16,7.05 L3.2 21.84,8.13 20.8,9.11 U9.1
N$56
  Top 0.254: R14.1 20.38,14.54 19.81,15.21 19.81,17.05 19.62,17.27 16.83,17.27 16.64,17.08 U7.5
  Top 0.305: C14.1 14.96,14.54 R15.1 16.38,14.88 16.51,15.05 16.51,15.56 U7.5
OUT1  (via drill 0.25 pad 0.6)
  Top 0.254: U3.1 2.33,11.38 2.54,11.18 5.49,11.18 v5.91,10.79
  5V 0.254: v5.91,10.79 5.94,10.79 5.97,10.76 7.24,10.76 7.33,10.67 12.83,10.67 14.67,8.83 18.73,8.83 19.81,9.91 19.81,16.26 16.76,19.3 v16.57,19.65
  Bottom 0.254: U2.26 16.8,19.21 v16.57,19.65
OUT2  (via drill 0.25 pad 0.6)
  Top 0.254: U3.2 4.7,10.73 5.27,10.16 v6.41,10.16
  5V 0.254: v6.41,10.16 7.11,10.16 7.18,10.1 12.7,10.1 14.41,8.38 18.92,8.38 20.26,9.72 20.26,16.51 17.53,19.24 v17.34,19.65
  Bottom 0.254: U2.27 17.45,19.42 v17.34,19.65
OUT3  (via drill 0.25 pad 0.6)
  Top 0.254: v5.87,9.56 5.17,9.56 4.45,10.29 2.48,10.29 2.27,10.08 U3.3
  5V 0.254: v5.87,9.56 6.92,9.56 6.95,9.53 12.57,9.53 14.16,7.94 19.11,7.94 20.7,9.53 20.7,14.22 22.16,15.68 v22.67,15.68
  Bottom 0.254: U2.38 22.62,15.7 v22.67,15.68
OUT4  (via drill 0.25 pad 0.6)
  Top 0.254: v6.41,8.95 2.73,8.95 2.25,9.43 U3.4
  5V 0.254: v6.41,8.95 12.45,8.95 13.91,7.49 19.3,7.49 21.14,9.34 21.14,13.97 22.23,15.05 23.18,15.05 23.62,14.61 v23.69,14.41
  Bottom 0.254: U2.39 23.24,15.05 23.62,14.61 v23.69,14.41
OUT5  (via drill 0.25 pad 0.6)
  Top 0.254: v5.84,8.35 5.71,8.51 2.54,8.51 2.29,8.76 1.62,8.76 U3.5
  5V 0.254: v5.84,8.35 6.86,8.35 6.89,8.38 12.32,8.38 13.65,7.05 19.49,7.05 21.59,9.14 21.59,13.72 22.29,14.41 v22.92,14.41
  Bottom 0.254: U2.40 22.65,14.4 v22.92,14.41
OUT6  (via drill 0.25 pad 0.6)
  Top 0.254: v6.41,7.75 6.35,7.81 6.32,7.71 5.56,7.71 5.21,8.06 2.29,8.06 2.22,8.13 U3.6
  5V 0.254: v6.41,7.75 12.22,7.75 13.4,6.6 19.68,6.6 22.04,8.95 22.04,13.21 v22.61,13.72
  Bottom 0.254: U2.41 22.64,13.75 v22.61,13.72
OVERCURRENT
  Bottom 0.254: U2.3 20.05,10.44 U9.3
PGC#1  (via drill 0.25 pad 0.6)
  Top 0.254: v0.98,15.3 0.38,15.68 0.38,20.7 0.76,21.08 2.79,21.08 SV1.5
  5V 0.254: v13.59,14.22 12.89,13.53 2.54,13.53 v0.98,15.3
  Bottom 0.254: U2.16 13.83,14.4 v13.59,14.22
PGD#1  (via drill 0.25 pad 0.6)
  5V 0.254: SV1.4 2.98,18.35 2.98,16.89 3.17,16.7 3.17,16.19 2.98,16 2.98,15.11 4.13,13.97 12.32,13.97 13.34,14.99 v13.59,14.99
  Bottom 0.254: U2.17 13.27,15.05 v13.59,14.99
POWER_TEMP  (via drill 0.25 pad 0.6)
  Top 0.305: U8.5 3.08,12.29 2.86,12.06 1.14,12.06 v1.02,12.19
  5V 0.254: v22.67,12.35 22.67,9.56 23.3,8.92 23.3,7.81 21.65,6.16 13.14,6.16 12.16,7.14 6.16,7.14 4.45,8.89 4.06,8.89 3.56,9.4 3.56,9.91 3.21,10.26 2.95,10.26 v1.02,12.19
  Bottom 0.254: U2.43 22.61,12.45 v22.67,12.35 | R17.1 1.69,14.61 1.69,13.61 1.71,13.59 R18.1 1.52,12.72 v1.02,12.19
  Bottom 0.305: C13.1 1.21,10.6 1.02,10.86 v1.02,12.19
PULL_SIGNAL_OUT1  (via drill 0.25 pad 0.6)
  5V 0.254: v13.53,11.94 13.4,12.32 12.92,12.79 6.13,12.79 v5.84,12.83
  Bottom 0.254: U2.14 13.93,13.1 13.78,12.95 13.78,12.19 v13.53,11.94 | RN3.4 6.18,13.11 v5.84,12.83
PULL_SIGNAL_OUT2
  Bottom 0.254: U2.15 14,13.75 13.84,13.59 13.21,13.59 12.89,13.91 7.81,13.91 7.47,13.57 RN3.3
SCL  (via drill 0.25 pad 0.6)
  Top 0.254: U8.6 4.04,12.7 v4.06,11.91 5.68,11.91 v5.81,12.03 | v5.81,12.03
  5V 0.254: v22.67,16.45 23.81,16.45 24.19,16.07 24.19,14.86 24.29,14.76 24.29,14.13 24.19,14.03 24.19,10.67 24.38,10.48 24.38,9.27 24.26,9.14 24.26,7.43 22.1,5.27 12.64,5.27 11.65,6.25 5.75,6.25 4.51,7.49 v4.25,7.43
  Bottom 0.254: U2.37 22.57,16.35 v22.67,16.45 | v4.06,11.91 4.06,12.95 3.75,13.27 R18.2 | v5.81,12.03 5.84,11.59 5.27,10.98 5.27,8.76 4.25,7.81 v4.25,7.43 4.25,7.87 4.11,8.02 U4.P$5
SCL_SDA_ENABLE  (via drill 0.25 pad 0.6)
  5V 0.254: v15.05,20.19 14.41,20.83 12.89,20.83 12.13,21.59 5.65,21.59 5.33,21.27 3.24,21.27 2.79,21.72 v2.79,22.16
  Bottom 0.254: U2.25 16.15,19.22 15.24,20.13 15.11,20.13 v15.05,20.19 | U4.P$3 3.15,10.31 3.56,9.91 3.56,9.4 3.08,8.92 2.7,8.92 2.67,8.89 2.67,8.28 U4.P$7 2.65,8.05 2.67,8.06 2.67,8.95 2.09,9.53 0.57,9.53 0.38,9.72 0.38,20.83 0.64,21.08 1.84,21.08 2.79,22.04 v2.79,22.16
SDA  (via drill 0.25 pad 0.6)
  Top 0.254: U8.1 4.08,15.68 3.62,16.07 3.24,16.45 v2.54,16.45
  5V 0.254: v23.37,13.72 23.3,13.65 23.3,10.92 23.94,10.29 23.94,9.53 23.75,9.34 23.75,7.62 21.91,5.71 12.89,5.71 11.91,6.7 5.94,6.7 4.25,8.45 3.87,8.45 2.86,9.46 v2.92,9.65
  Bottom 0.254: U2.42 22.88,13.1 23.37,13.59 v23.37,13.72 | v2.54,16.45 2.69,16.28 2.71,16.28 3.62,15.37 R17.2 3,14.95 2.83,14.83 2.83,14.29 2.41,13.91 2.41,12.64 2.15,12.38 U4.P$1 2.15,10.1 2.6,9.65 v2.92,9.65
SIGNAL_OUT1  (via drill 0.25 pad 0.6)
  Top 0.305: RN3.5 6.67,15.49 v6.54,15.62 6.41,15.75 6.03,15.75 5.33,16.45 5.33,17.91 6.03,18.61 6.03,19.42 U6.6
  5V 0.254: 16.61,10.19 v16.54,10.03 16.51,15.11 16.73,15.34 16.73,16.32 16.61,16.48 16.61,17.56 13.78,20.38 12.7,20.38 11.94,21.14 10.16,21.14 9.78,20.77 9.78,20.07 8.92,19.21 7.53,19.21 6.54,18.22 v6.54,15.62
  Bottom 0.254: RN3.5 6.67,15.49 v6.54,15.62 6.35,15.81 5.27,15.81 4.7,15.3 4.7,11.72 4.32,11.3 2.86,11.3 2.65,11.1 U4.P$2 | U2.8 16.76,11.05 16.57,10.79 16.54,10.7 v16.54,10.03
SIGNAL_OUT2  (via drill 0.25 pad 0.6)
  Top 0.305: RN3.6 7.47,15.51 v7.37,15.62 6.79,16.26 6.29,16.26 6.04,16.51 U6.1
  5V 0.254: v15.94,10.54 15.94,15.24 16.29,15.59 16.29,16.16 16.07,16.38 16.07,17.46 13.59,19.94 12.03,19.94 11.97,19.88 10.29,19.88 9.11,18.7 7.65,18.7 7.24,18.29 7.24,15.75 v7.37,15.62
  Bottom 0.254: U2.9 16.15,11.13 v15.94,10.54 | v7.37,15.62 7.47,15.51 RN3.6 7.47,14.21 7.18,13.91 6.03,13.91 5.21,13.08 5.21,11.59 4.83,11.18 4.83,9.21 4.38,8.76 3.59,8.76 3.15,8.33 U4.P$6

### Text on the board
tNames: OMHBN | 3_1 | OpenMotics
bNames: 2016